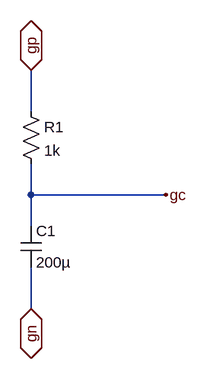
[diagram p0: schematic Draft1.asc]
Draft1.asc, the LTspice schematic file:
Version 4
SHEET 1 880 680
WIRE 80 128 80 64
WIRE 80 256 80 208
WIRE 288 256 80 256
WIRE 80 304 80 256
WIRE 80 432 80 368
FLAG 80 64 gp
IOPIN 80 64 BiDir
FLAG 80 432 gn
IOPIN 80 432 BiDir
FLAG 288 256 gc
SYMBOL res 64 112 R0
SYMATTR InstName R1
SYMATTR Value 1k
SYMBOL cap 64 304 R0
SYMATTR InstName C1
SYMATTR Value 200µ

The netlist it stands for:
* Draft1.asc
R1 gp gc 1k
C1 gc gn 200µ
.backanno
.end